# EasyEDA Pro project ProPrj_Compact_LED_Driver_PWM_Single_ATtiny1616_Double_2024-10-07.epro, board PCB1
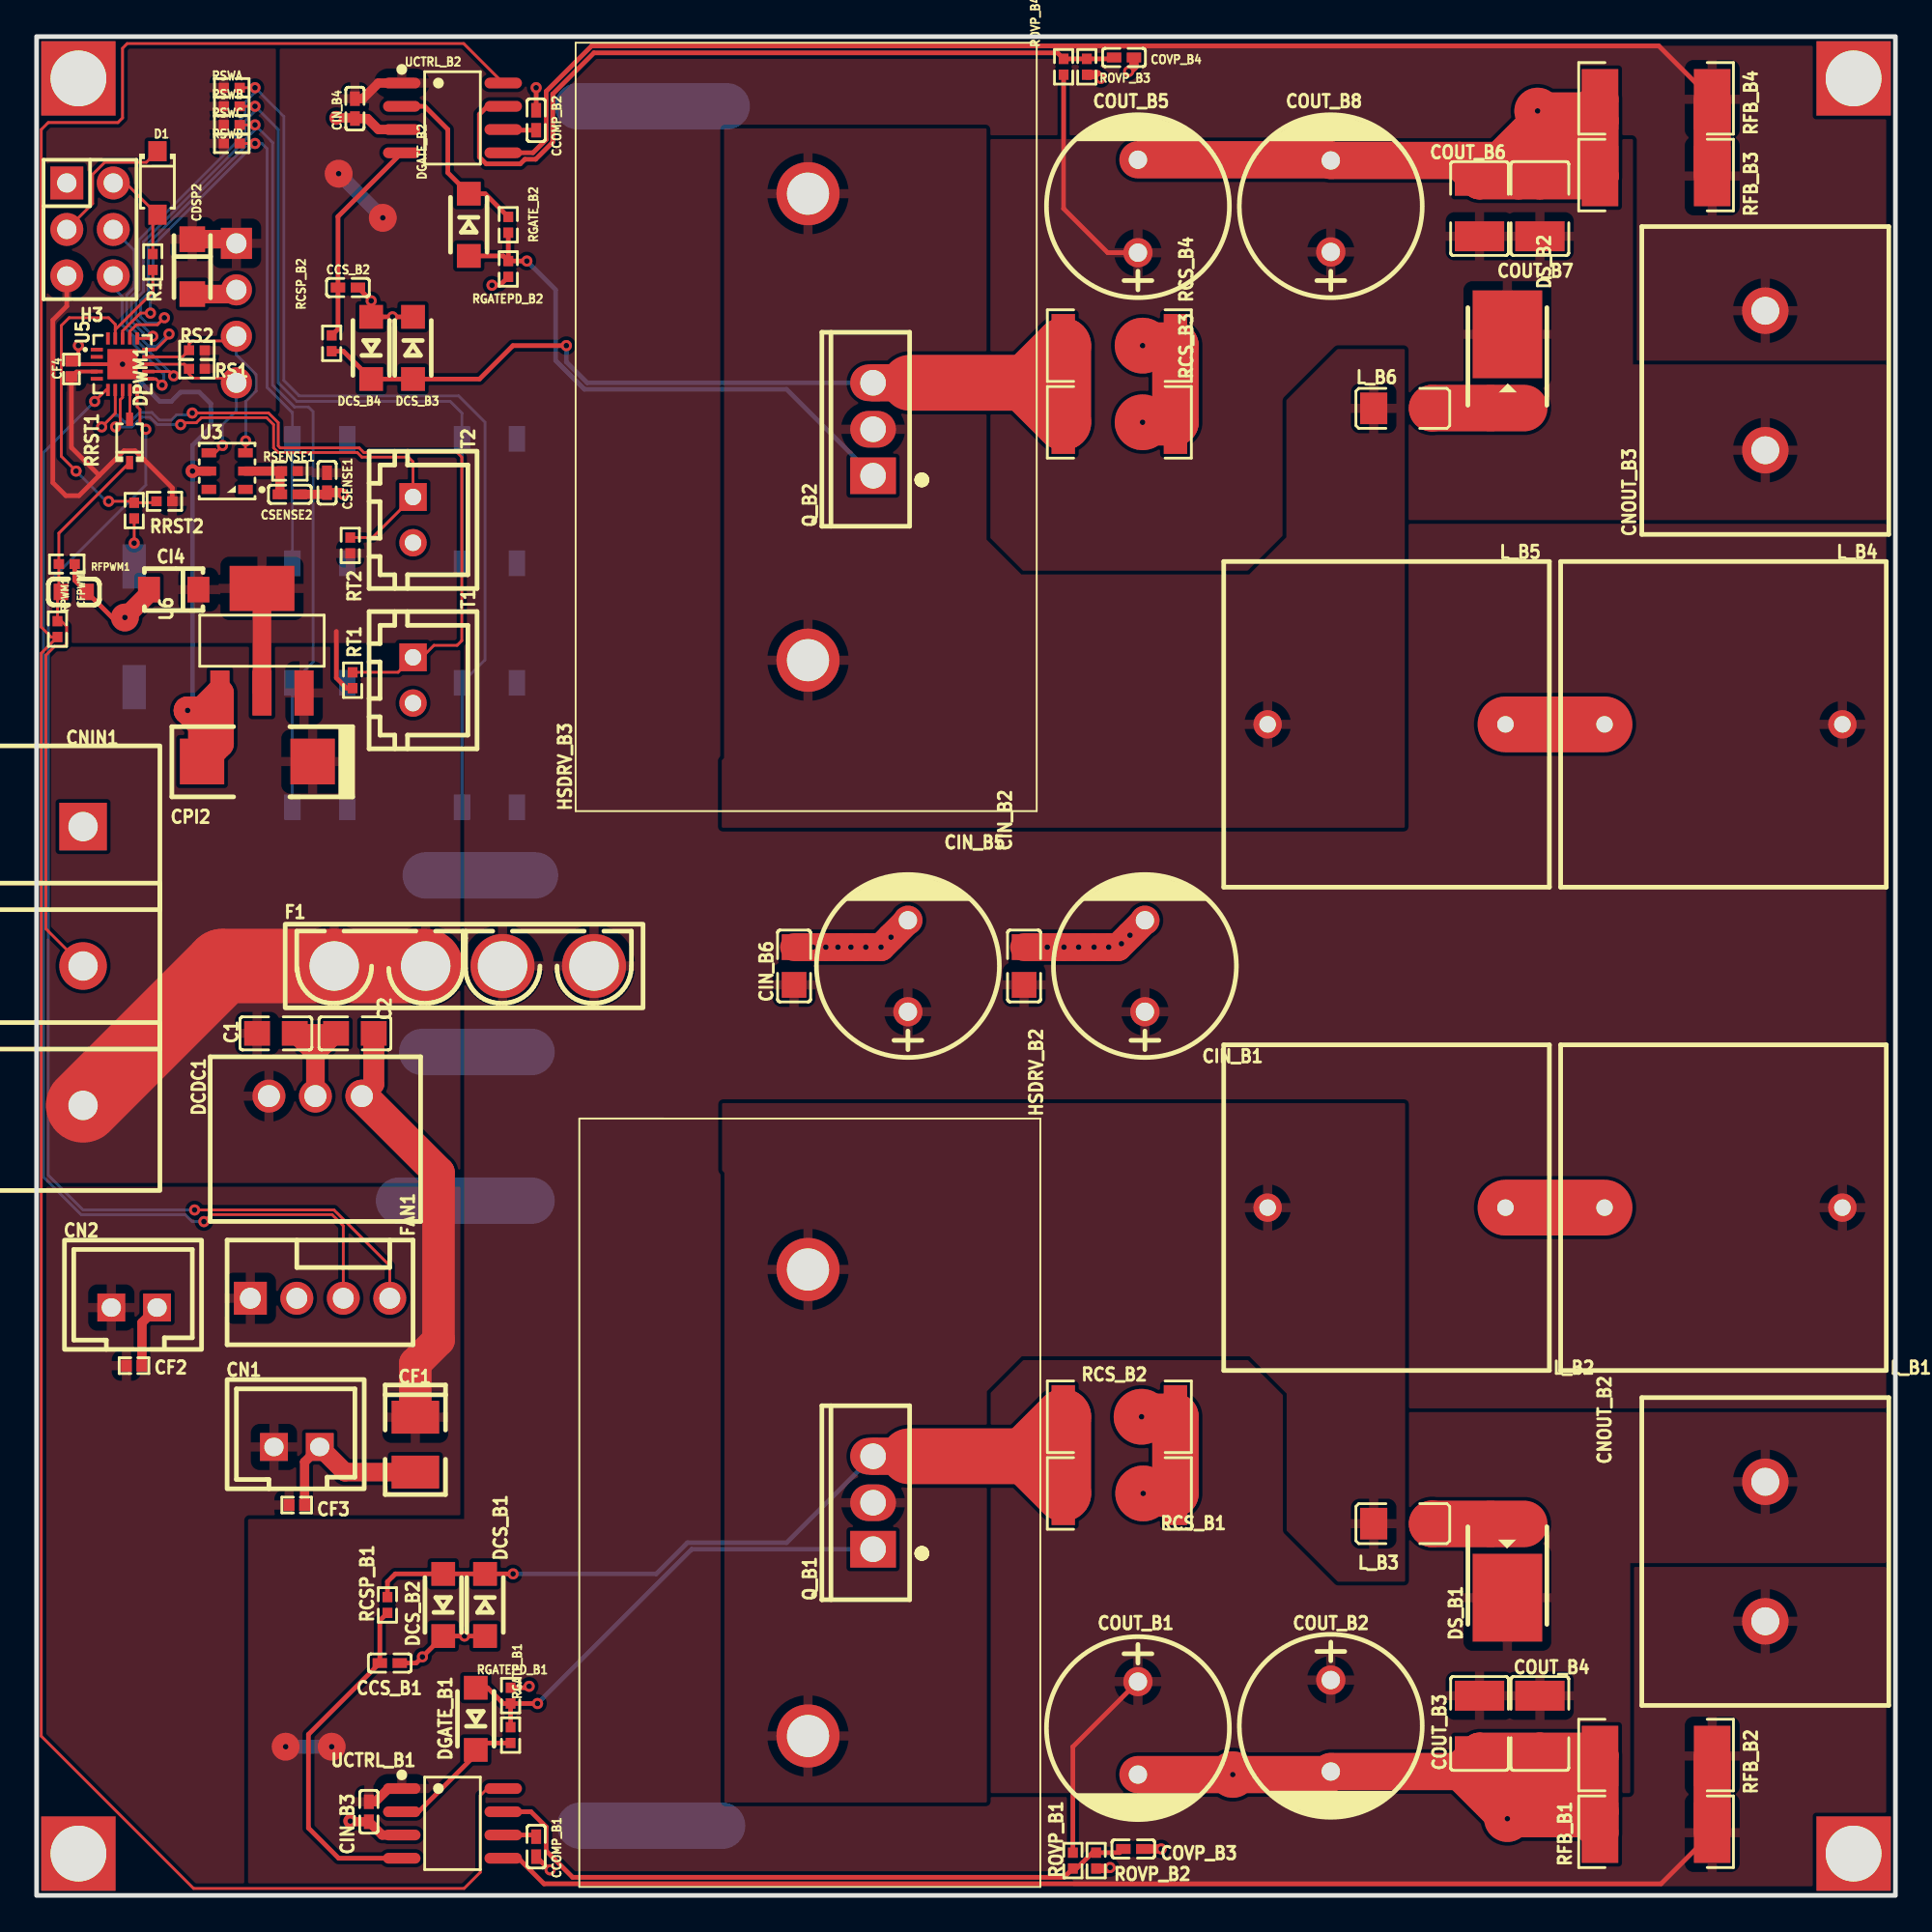
[diagram p1: board, top side]
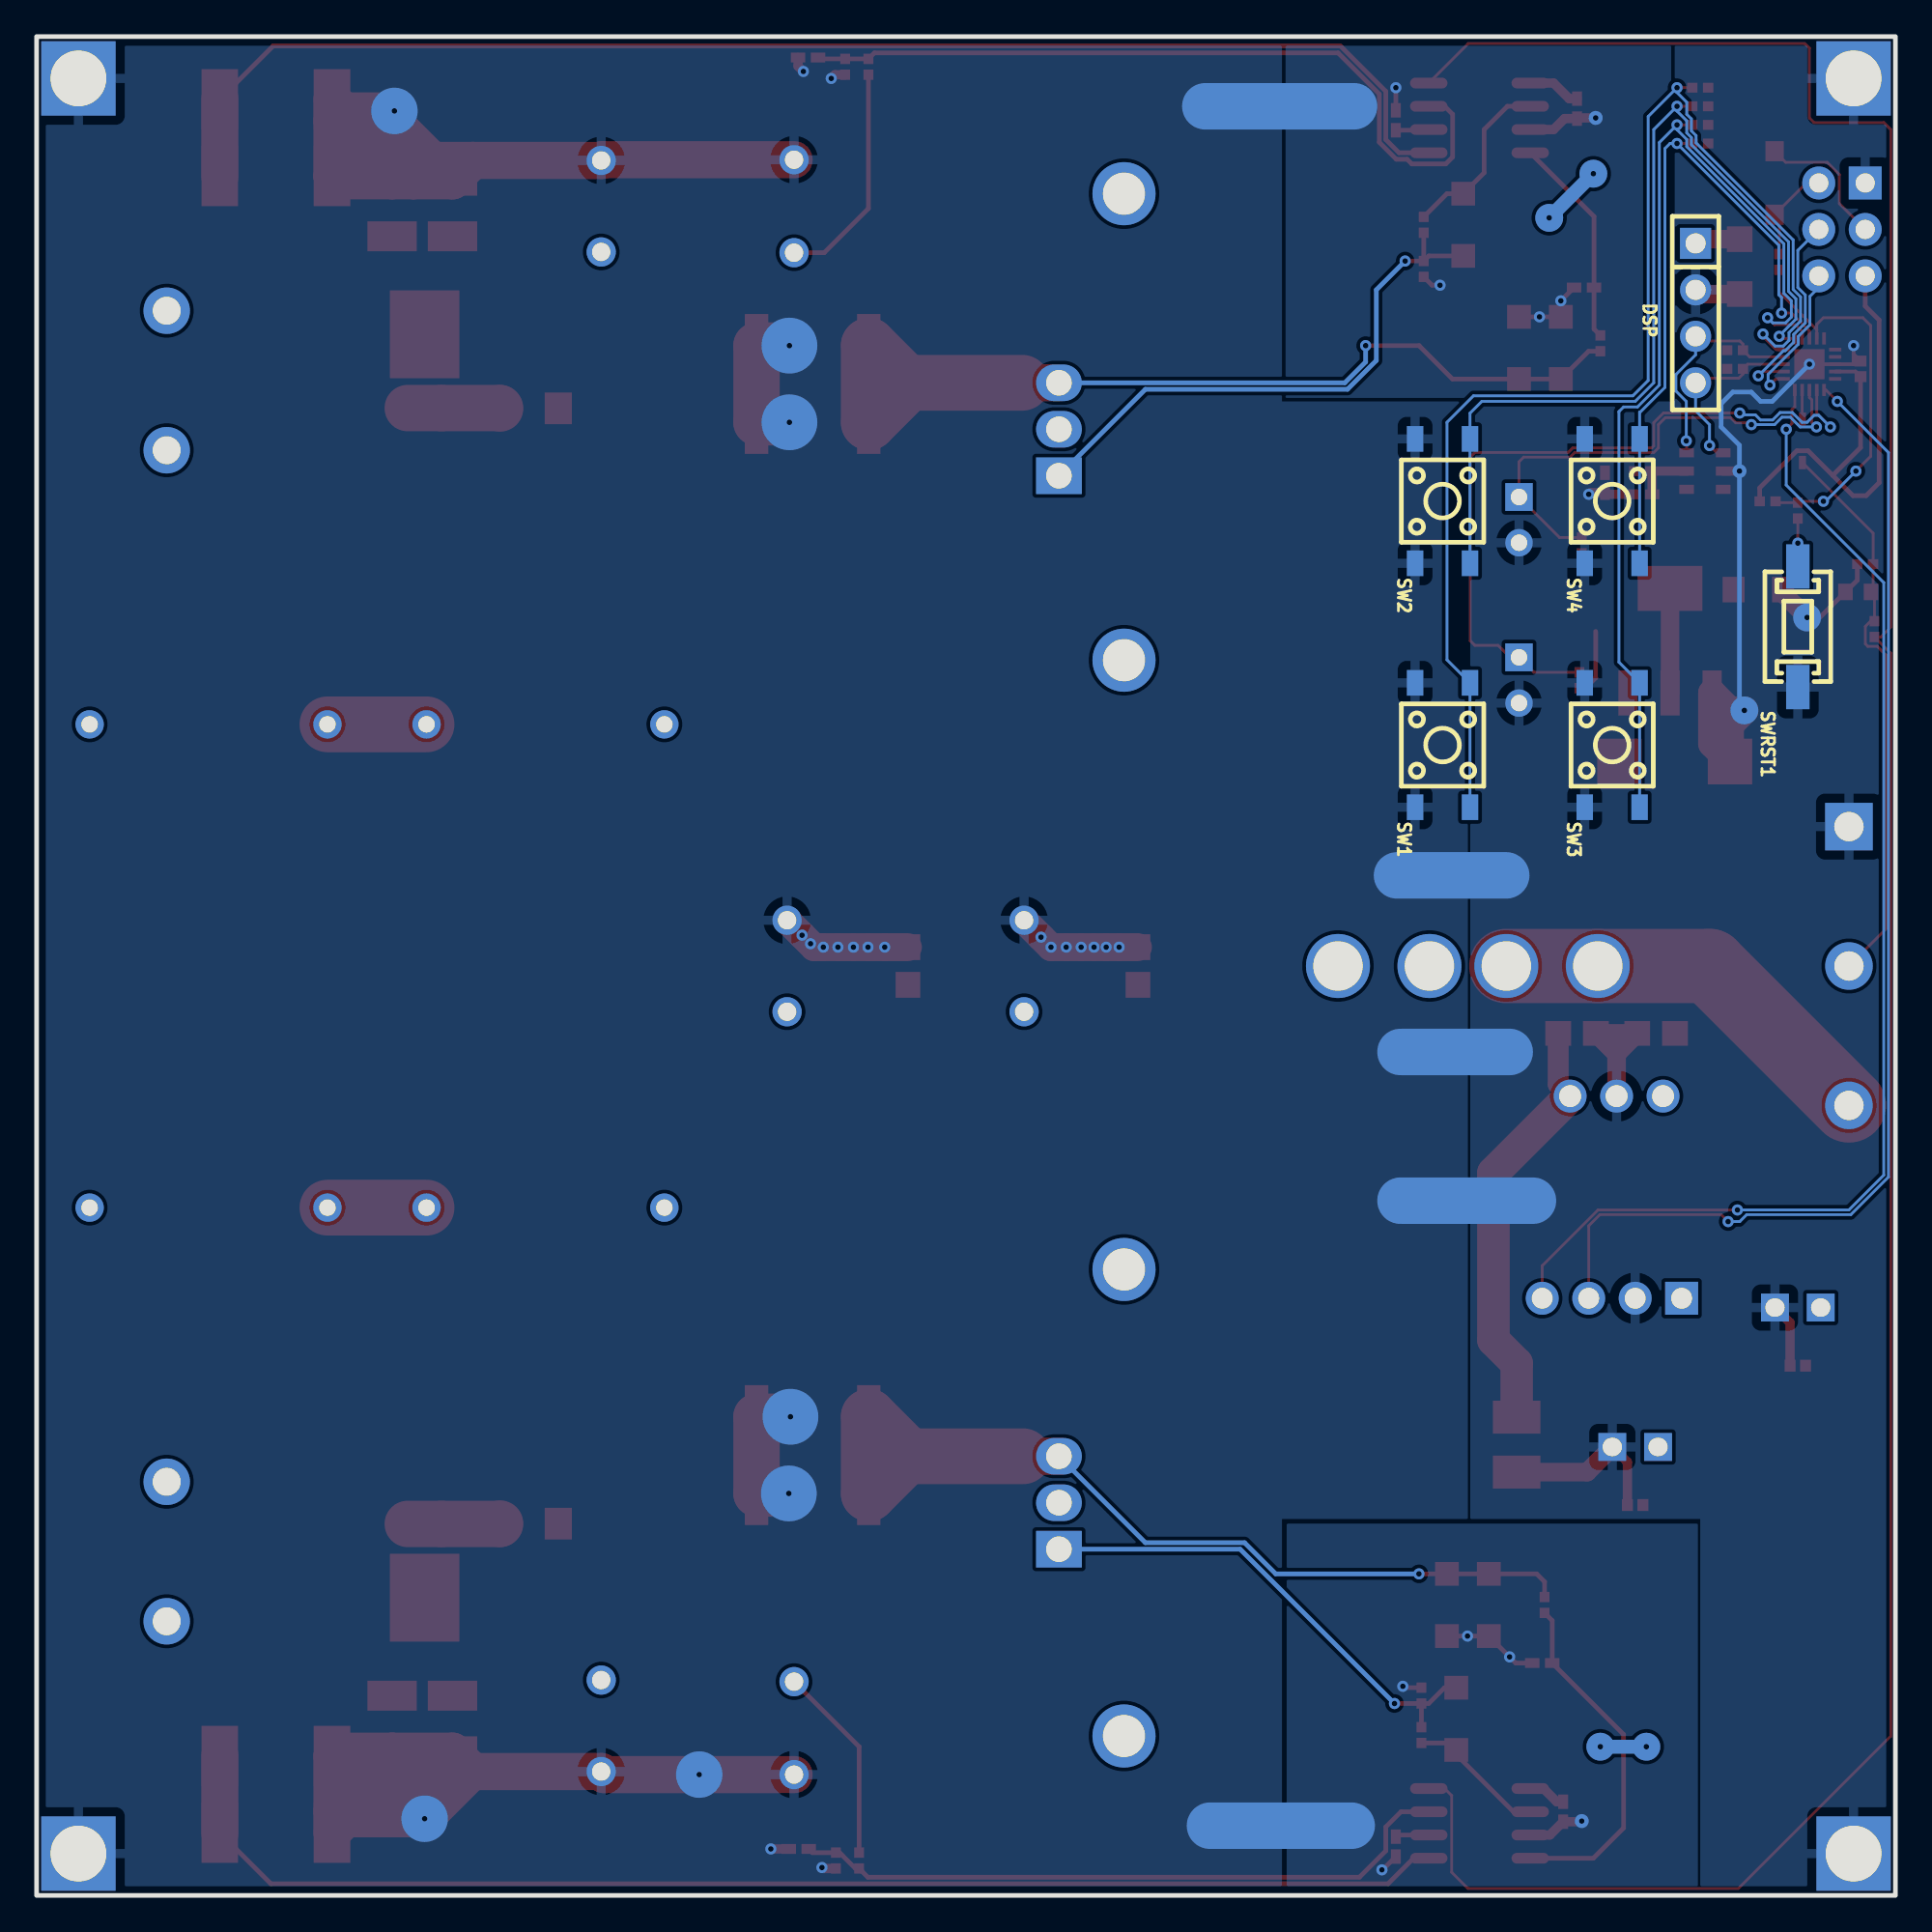
[diagram p2: board, bottom side, seen from below]

Outline 101.6 x 101.6 mm; copper layers: Top Layer, Bottom Layer. Coordinates in mm from the lower left corner of the outline.
Outline path: rectangle 0,101.6 101.6,0
Stack: Top Layer 0.035mm / Dielectric1 1.51mm FR4 er 4.5 / Bottom Layer 0.035mm

## Design rules (mm)
template: Custom Config
spacing copperThickness1oz (default): track to track 0.102, other pairs 0.025 to 0.3
spacing copperThickness2oz: track to track 0.203, other pairs 0.152 to 0.3
track width copperThickness1oz (default): min 0.127, default 0.254, max 5.08
track width copperThickness2oz: min 0.203, default 0.254, max 2.54
differential pair differentialPair (default): width min 0.127, default 0.254, max 2.54; gap min 0.152, default 0.152
via viaSize (default): diameter min 0.5, default 0.61, max 10; hole min 0.3, default 0.305, max 6.299

## Placement (name value [footprint] x y rotation side)
C1  22uF  [C0805]  13.08 47.12 0 top
C2  22uF  [C0805]  17.4 47.12 180 top
CCOMP_B1  220nF  [C0402]  27.31 2.67 270 top
CCOMP_B2  220nF  [C0402]  27.31 97.03 90 top
CCS_B1  100pF  [C0402]  19.3 12.7 0 top
CCS_B2  100pF  [C0402]  17.02 87.88 0 top
CDSP2  10uF  [CAP-SMD_L3.2-W1.6-R-RD]  8.51 89.03 90 top
CF1  10uF  [CAP-SMD_L3.5-W2.8]  20.7 24.64 270 top
CF2  1uF  [0402]  5.33 28.96 0 top
CF3  1uF  [0402]  14.22 21.34 0 top
CF4  1uF  [0402]  1.91 83.44 90 top
CFPWM1  1nF  [C0603]  2.03 71.25 180 top
CI4  10uF  [CAP-SMD_L3.2-W1.6]  7.49 71.37 180 top
CIN_B1  100uF  [CAP-TH_BD10.0-P5.00-D0.6-FD-A]  60.58 50.8 90 top
CIN_B2  10uF  [C0805]  53.97 50.8 90 top
CIN_B3  1uF  [C0402]  18.16 4.57 90 top
CIN_B4  1uF  [C0402]  17.4 97.66 90 top
CIN_B5  100uF  [CAP-TH_BD10.0-P5.00-D0.6-FD-A]  47.62 50.8 90 top
CIN_B6  10uF  [C0805]  41.4 50.8 90 top
CN1  WAFER-XH2.54-2PZZ  [CONN-TH_XH2.54-2P]  14.22 24.51 0 top
CN2  WAFER-XH2.54-2PZZ  [CONN-TH_XH2.54-2P]  5.33 32.13 0 top
CNIN1  DBT50G-7.62-3P-BK-P  [CONN-TH_3P-P7.62_L15.2-W24.4-EX4.2]  2.54 50.8 270 top
CNOUT_B2  WJ25C-B-2P  [CONN-TH_2P-P7.62_WJ25C-B-7.62-2P]  94.49 18.8 270 top
CNOUT_B3  WJ25C-B-2P  [CONN-TH_2P-P7.62_WJ25C-B-7.62-2P]  94.49 82.8 90 top
COUT_B1  330uF  [CAP-TH_BD10.0-P5.00-D1.0-FD]  60.2 9.14 270 top
COUT_B2  220uF  [CAP-TH_BD10.0-P5.00-D0.6-FD-A]  70.74 9.27 270 top
COUT_B3  4.7uF  [C1210]  78.87 9.4 90 top
COUT_B4  4.7uF  [C1210]  82.17 9.4 90 top
COUT_B5  330uF  [CAP-TH_BD10.0-P5.00-D1.0-FD]  60.2 92.33 90 top
COUT_B6  4.7uF  [C1210]  78.87 92.2 270 top
COUT_B7  4.7uF  [C1210]  82.17 92.2 270 top
COUT_B8  220uF  [CAP-TH_BD10.0-P5.00-D0.6-FD-A]  70.74 92.33 90 top
COVP_B3  470pF  [C0402]  59.94 2.54 180 top
COVP_B4  470pF  [C0402]  59.44 100.46 180 top
CPI2  10uF  [CASE-C_6032]  12.06 61.98 0 top
CSENSE1  10uF  [C0402]  15.88 77.22 90 top
CSENSE2  100nF  [C0402]  13.84 76.58 180 top
D1  B5819W  [SOD-123F_L2.7-W1.6-LS3.8-RD-1]  6.6 93.6 270 top
DCDC1  K7812-1000  [PWRM-TH_K78XX-1000]  15.24 43.69 0 top
DCS_B1  MMSD4148T3G  [SOD-123FL_L2.6-W1.6-LS3.4-RD]  24.51 15.88 270 top
DCS_B2  MMSD4148T3G  [SOD-123FL_L2.6-W1.6-LS3.4-RD]  22.22 15.88 90 top
DCS_B3  MMSD4148T3G  [SOD-123FL_L2.6-W1.6-LS3.4-RD]  20.57 84.58 270 top
DCS_B4  MMSD4148T3G  [SOD-123FL_L2.6-W1.6-LS3.4-RD]  18.29 84.58 90 top
DGATE_B1  MMSD4148T3G  [SOD-123FL_L2.6-W1.6-LS3.4-RD]  24 9.65 90 top
DGATE_B2  MMSD4148T3G  [SOD-123FL_L2.6-W1.6-LS3.4-RD]  23.62 91.31 270 top
DPWM1  CUS08F30,H3F  [SOD-323F_L2.0-W1.6-LS2.5-RD]  5.08 79.5 90 top
DS_B1  ST2045  [TO-277_3P-L5.4-W4.0-LS6.5-BR]  80.39 18.29 90 top
DS_B2  ST2045  [TO-277_3P-L5.4-W4.0-LS6.5-BR]  80.39 83.31 270 top
DSP  2.54-1*4P母  [HDR-TH_4P-P2.54-V-F]  10.92 86.49 270 bottom
F1  XF-507P  [CONN-TH_XF-507P]  23.37 50.8 0 top
FAN1  HF1004E  [CONN-TH_4P-P2.54_HF1004E]  15.49 32.64 0 top
H3  Header-Male-2.54_2x3  [HDR-TH_6P-P2.54-V-M-R2-C3-S2.54-1]  2.92 91.06 270 top
HSDRV_B2  -  [xsd366094]  42.16 21.46 270 top
HSDRV_B3  -  [xsd366094]  42.16 80.26 90 top
L_B1  47uH  [IND-TH_L17.8-W17.8-P13.00-D0.6]  92.2 37.59 180 top
L_B2  47uH  [IND-TH_L17.8-W17.8-P13.00-D0.6]  73.79 37.59 180 top
L_B3  HCB3216KF-300T80  [L1206]  74.68 20.32 0 top
L_B4  47uH  [IND-TH_L17.8-W17.8-P13.00-D0.6]  92.2 64.01 180 top
L_B5  47uH  [IND-TH_L17.8-W17.8-P13.00-D0.6]  73.79 64.01 180 top
L_B6  HCB3216KF-300T80  [L1206]  74.68 81.28 0 top
NOREF  -  [Pad_e112]  99.31 99.31 0 top
NOREF#2  -  [Pad_e110]  2.29 2.29 0 top
NOREF#3  -  [Pad_e108]  2.29 99.31 0 top
NOREF#4  -  [Pad_e111]  99.31 2.29 0 top
Q_B1  LPN1510C  [TO-220-3_L10.0-W4.5-P2.54-L]  45.72 21.46 90 top
Q_B2  LPN1510C  [TO-220-3_L10.0-W4.5-P2.54-L]  45.72 80.14 90 top
R1  470Ω  [R0402]  6.35 89.28 270 top
RCS_B1  60mΩ  [R2512]  59.18 21.97 180 top
RCS_B2  60mΩ  [R2512]  59.18 26.16 180 top
RCS_B3  60mΩ  [R2512]  59.18 80.52 180 top
RCS_B4  60mΩ  [R2512]  59.18 84.71 180 top
RCSP_B1  100Ω  [R0402]  19.18 15.88 90 top
RCSP_B2  100Ω  [R0402]  16.13 84.84 270 top
RFB_B1  130mΩ  [RES-SMD_L6.4-W3.2-R2512]  88.52 3.43 0 top
RFB_B2  130mΩ  [RES-SMD_L6.4-W3.2-R2512]  88.52 7.62 0 top
RFB_B3  130mΩ  [RES-SMD_L6.4-W3.2-R2512]  88.52 93.98 0 top
RFB_B4  130mΩ  [RES-SMD_L6.4-W3.2-R2512]  88.52 98.17 0 top
RFPWM1  20kΩ  [R0402]  1.65 72.77 180 top
RGATE_B1  10Ω  [R0402]  25.91 8.76 270 top
RGATE_B2  10Ω  [R0402]  25.78 91.31 90 top
RGATEPD_B1  10kΩ  [R0402]  25.91 10.92 270 top
RGATEPD_B2  10kΩ  [R0402]  25.78 88.9 90 top
ROVP_B1  360kΩ  [R0402]  56.64 1.91 90 top
ROVP_B2  18.7kΩ  [R0402]  57.91 1.91 90 top
ROVP_B3  18.7kΩ  [R0402]  57.4 99.95 90 top
ROVP_B4  360kΩ  [R0402]  56.13 99.95 270 top
RPWM1  1kΩ  [R0402]  1.14 69.21 90 top
RRST1  100Ω  [R0402]  5.33 75.69 270 top
RRST2  10kΩ  [R0402]  6.98 76.2 0 top
RS1  1kΩ  [R0402]  8.76 83.44 0 top
RS2  1kΩ  [R0402]  8.76 84.45 0 top
RSENSE1  220Ω  [R0402]  13.84 77.85 180 top
RSWA  10kΩ  [R0402]  10.67 98.81 180 top
RSWB  10kΩ  [R0402]  10.67 97.79 180 top
RSWC  10kΩ  [R0402]  10.67 96.77 180 top
RSWD  10kΩ  [R0402]  10.67 95.76 180 top
RT1  10kΩ  [R0402]  17.27 66.42 90 top
RT2  10kΩ  [R0402]  17.14 73.79 90 top
SW1  TS4543TP 250gf 009  [SW-SMD_4P-L4.5-W4.5-P3.00-LS6.9]  24.75 62.88 90 bottom
SW2  TS4543TP 250gf 009  [SW-SMD_4P-L4.5-W4.5-P3.00-LS6.9]  24.75 76.21 90 bottom
SW3  TS4543TP 250gf 009  [SW-SMD_4P-L4.5-W4.5-P3.00-LS6.9]  15.48 62.88 90 bottom
SW4  TS4543TP 250gf 009  [SW-SMD_4P-L4.5-W4.5-P3.00-LS6.9]  15.48 76.21 90 bottom
SWRST1  TSB008A2518A  [SW-SMD_L6.0-W3.5-LS8.2]  5.33 69.34 90 bottom
T1  HC-XH-2A-G  [CONN-TH_2P-P2.50_HC-XH-2A-G]  20.57 66.42 270 top
T2  HC-XH-2A-G  [CONN-TH_2P-P2.50_HC-XH-2A-G]  20.57 75.18 270 top
U3  AHT20  [SENSOR-SMD_L3.0-W3.0-P1.00-BR]  10.41 77.85 0 top
U5  ATTINY1616-MNR  [QFN-20_L3.0-W3.0-P0.40-BL-EP1.7]  4.7 83.69 270 top
U6  SK1117-5.0  [SOT-223_L6.5-W3.5-P2.30-LS7.0-BR]  12.32 68.58 270 top
UCTRL_B1  AL3353S-13  [SOIC-8_L4.9-W3.9-P1.27-LS6.0-BL]  22.73 3.94 270 top
UCTRL_B2  AL3353S-13  [SOIC-8_L4.9-W3.9-P1.27-LS6.0-BL]  22.73 97.16 270 top

## Footprints (pads in the part's own frame, mm; a bottom-side part is the same pattern mirrored in y, then rotated)
0402
  rect 0.6x0.65 smd: 1(-0.424,0) 2(0.424,0)
C0402
  rect 0.79x0.54 smd: 1(-0.545,0) 2(0.545,0)
C0603
  rect 0.8x0.9 smd: 1(-0.7,0) 2(0.7,0)
C0805
  rect 1.41x1.35 smd: 1(-1.03,0) 2(1.03,0)
C1210
  rect 1.635x2.7 smd: 1(-1.518,0) 2(1.518,0)
CAP-SMD_L3.2-W1.6
  rect 1.2x1.4 smd: 1(-1.35,0) 2(1.35,0)
CAP-SMD_L3.2-W1.6-R-RD
  rect 1.4x1.4 smd: 1(1.5,0) 2(-1.5,0)
CAP-SMD_L3.5-W2.8
  rect 1.8x2.6 smd: 1(-1.501,0) 2(1.501,0)
CAP-TH_BD10.0-P5.00-D0.6-FD-A
  round 1.6 hole 1: 1(-2.5,0) 2(2.5,0)
CAP-TH_BD10.0-P5.00-D1.0-FD
  round 1.6 hole 1: 1(-2.54,0) 2(2.54,0)
CASE-C_6032
  rect 2.425x2.5 smd: 1(3.022,0) 2(-3.022,0)
CONN-TH_2P-P2.50_HC-XH-2A-G
  rect 1.524x1.5 hole 0.9: 1(-1.25,0)
  round 1.5 hole 0.9: 2(1.25,0)
CONN-TH_2P-P7.62_WJ25C-B-7.62-2P
  round 2.54 hole 1.524: 1(-3.812,0) 2(3.812,0)
CONN-TH_3P-P7.62_L15.2-W24.4-EX4.2
  rect 2.6x2.6 hole 1.6: 1(-7.62,0)
  round 2.6 hole 1.6: 2(0,0) 3(7.62,0)
CONN-TH_4P-P2.54_HF1004E
  rect 1.8x1.8 hole 1.14: 1(-3.81,0)
  round 1.8 hole 1.14: 2(-1.27,0) 3(1.27,0) 4(3.81,0)
CONN-TH_XF-507P
  round 3.5 hole 2.7: 1(-7.1,0) 2(-2.1,0) 3(2.1,0) 4(7.1,0)
CONN-TH_XH2.54-2P
  rect 1.524x1.524 hole 1.05x1: 1(-1.25,0) 2(1.25,0)
HDR-TH_4P-P2.54-V-F
  rect 1.7x1.7 hole 1.1: 1(-3.81,0)
  round 1.7 hole 1.1: 2(-1.27,0) 3(1.27,0) 4(3.81,0)
HDR-TH_6P-P2.54-V-M-R2-C3-S2.54-1
  rect 1.8x1.8 hole 1.05: 1(-2.54,-1.27)
  round 1.8 hole 1.05: 2(-2.54,1.27) 3(0,-1.27) 4(0,1.27) 5(2.54,-1.27) 6(2.54,1.27)
IND-TH_L17.8-W17.8-P13.00-D0.6
  round 1.55 hole 0.9: 1(-6.5,0) 2(6.5,0)
L1206
  rect 1.485x1.728 smd: 1(-1.593,0) 2(1.593,0)
Pad_e108
  rect 4.064x4.064 hole 3.048: 33(0,0)
Pad_e110
  rect 4.064x4.064 hole 3.048: 33(0,0)
Pad_e111
  rect 4.064x4.064 hole 3.048: 33(0,0)
Pad_e112
  rect 4.064x4.064 hole 3.048: 33(0,0)
PWRM-TH_K78XX-1000
  round 1.8 hole 1.2: 1(-2.54,0) 2(0,0) 3(2.54,0)
QFN-20_L3.0-W3.0-P0.40-BL-EP1.7
  rect 0.2x0.665 smd: 1(-0.8,-1.407) 2(-0.4,-1.407) 3(0,-1.407) 4(0.4,-1.407) 5(0.8,-1.407) 11(0.8,1.407) 12(0.4,1.407) 13(0,1.407) 14(-0.4,1.407) 15(-0.8,1.407)
  rect 0.665x0.2 smd: 6(1.407,-0.8) 7(1.407,-0.4) 8(1.407,0) 9(1.407,0.4) 10(1.407,0.8) 16(-1.407,0.8) 17(-1.407,0.4) 18(-1.407,0) 19(-1.407,-0.4) 20(-1.407,-0.8)
  rect 1.65x1.65 smd: 21(0,0)
R0402
  rect 0.566x0.54 smd: 1(-0.433,0) 2(0.433,0)
R2512
  rect 1.282x3.456 smd: 1(-3.067,0) 2(3.067,0)
RES-SMD_L6.4-W3.2-R2512
  rect 2x3.3 smd: 1(-3.067,0) 2(3.067,0)
SENSOR-SMD_L3.0-W3.0-P1.00-BR
  rect 0.8x0.5 smd: 1(1,-1) 2(1,0) 3(1,1) 4(-1,1) 5(-1,0) 6(-1,-1)
SOD-123F_L2.7-W1.6-LS3.8-RD-1
  rect 1.1x1 smd: 1(-1.735,0) 2(1.735,0)
SOD-123FL_L2.6-W1.6-LS3.4-RD
  rect 1.3x1.3 smd: 1(-1.7,0) 2(1.7,0)
SOD-323F_L2.0-W1.6-LS2.5-RD
  rect 0.73x0.385 smd: 1(-1.185,0) 2(1.185,0)
SOIC-8_L4.9-W3.9-P1.27-LS6.0-BL
  oval 0.588x2.045 smd: 1(-1.905,-2.772) 2(-0.635,-2.772) 3(0.635,-2.772) 4(1.905,-2.772) 5(1.905,2.772) 6(0.635,2.772) 7(-0.635,2.772) 8(-1.905,2.772)
SOT-223_L6.5-W3.5-P2.30-LS7.0-BR
  rect 2.465x1.05 smd: 1(2.857,-2.3) 2(2.857,0) 3(2.857,2.3)
  rect 2.465x3.54 smd: 4(-2.857,0)
SW-SMD_4P-L4.5-W4.5-P3.00-LS6.9
  rect 1.4x0.9 smd: 1(-3.4,1.5) 2(3.4,1.5) 3(-3.4,-1.5) 4(3.4,-1.5)
SW-SMD_L6.0-W3.5-LS8.2
  rect 2.42x1.28 smd: 1(-3.296,0) 2(3.296,0)
TO-220-3_L10.0-W4.5-P2.54-L
  rect 2x2.5 hole 1.4: 1(-2.54,0)
  oval 2x2.5 hole 1.4: 2(0,0) 3(2.54,0)
TO-277_3P-L5.4-W4.0-LS6.5-BR
  rect 1.29x1.423 smd: 1(2.017,-0.92) 3(2.017,0.92)
  rect 4.8x3.8 smd: 2(-2.017,0)
xsd366094
  round 3.45 hole 2.3: 1(-12.749,0) 2(12.749,0)

## Nets
As in the schematic, except:
AGND: C1.2 C2.2 CCOMP_B1.2 CCOMP_B2.2 CCS_B1.2 CCS_B2.2 CDSP2.2 CF1.2 CF2.2 CF3.2 CF4.2 CFPWM1.1 CI4.2 CIN_B1.2 CIN_B2.2 CIN_B3.1 CIN_B4.1 CIN_B5.2 CIN_B6.2 CN1.2 CN2.2 CNIN1.1 COUT_B1.2 COUT_B2.2 COUT_B3.1 COUT_B4.1 COUT_B5.2 COUT_B6.1 COUT_B7.1 COUT_B8.2 COVP_B3.1 COVP_B4.1 CPI2.2 CSENSE1.1 CSENSE2.1 DCDC1.2 DCS_B1.2 DCS_B2.1 DCS_B3.1 DCS_B4.2 DSP.2 FAN1.2 H3.1 NOREF.33 NOREF#2.33 NOREF#3.33 NOREF#4.33 RCS_B1.1 RCS_B2.1 RCS_B3.1 RCS_B4.1 RFB_B1.1 RFB_B2.1 RFB_B3.1 RFB_B4.1 RFPWM1.1 RGATEPD_B1.1 RGATEPD_B2.1 ROVP_B2.1 ROVP_B3.1 SW1.1 SW1.2 SW2.1 SW2.2 SW3.1 SW3.2 SW4.1 SW4.2 SWRST1.1 T1.2 T2.2 U3.5 U5.3 U5.21 U6.1 UCTRL_B1.3 UCTRL_B2.3

Pads without a net: U3 1 6; U5 1 2 5 20

## Via types
v1: diameter 0.61, hole 0.305, Top Layer to Bottom Layer, 55 vias
v2: diameter 2.54, hole 0.305, Top Layer to Bottom Layer, 1 via
v3: diameter 2.54, hole 0.3, Top Layer to Bottom Layer, 2 vias
v4: diameter 0.762, hole 0.305, Top Layer to Bottom Layer, 2 vias
v5: diameter 3.048, hole 0.305, Top Layer to Bottom Layer, 4 vias
v6: diameter 0.762, hole 0.3, Top Layer to Bottom Layer, 1 via
v7: diameter 1.524, hole 0.305, Top Layer to Bottom Layer, 6 vias
v8: diameter 0.61, hole 0.3, Top Layer to Bottom Layer, 1 via

## Routing (per net, layer and track width the routed paths; a pad name or vN(x,y) marks a point on that pad's centre or on a via; arc(x,y) is an arc through that point)
+5V: length 40.4
  Top Layer w0.203: U5.4 2.18,83.29 1.91,83.02
  Top Layer w0.254: RRST2.2 7.42,76.93 5.39,78.96 4.77,78.96 3.43,77.62 ; 3.43,77.62 1.91,79.14 1.91,83.02 ; 3.43,77.62 2.32,76.51 1.6,76.51 0.89,77.22 0.89,86.11 1.65,86.87 H3.5 ; RT1.1 16.94,65.99 16.38,66.55 16.38,69.09
  Top Layer w1.016: U6.2 U6.4 ; CDSP2.1 10.69,90.53 DSP.1
+12V: length 23.5
  Top Layer w1.143: C2.1 18.43,44.34 DCDC1.3
  Top Layer w1.778: CF1.1 20.7,29.08 21.97,30.35 21.97,39.5 DCDC1.3
AGND: length 276.6
  Top Layer w0.203: 2.29,84.24 2.29,83.72 2.31,83.69 ; 2.29,84.24 CF4.2 2.08,83.69 2.31,83.69 ; 2.29,84.24 v1(2.29,84.71) ; 2.31,83.69 U5.3 v1(4.7,83.69)
  Top Layer w0.254: RGATEPD_B2.1 25.33,88.01 v1(24.89,88.01) ; DCS_B1.2 v1(23.39,14.17) DCS_B2.1 v1(21.09,13.04) 20.75,12.7 CCS_B1.2 ; DCS_B3.1 v1(19.45,86.28) DCS_B4.2 v1(18.29,87.16) CCS_B2.2 ; v1(26.92,11.43) 26.85,11.35 RGATEPD_B1.1 ; v8(28.07,1.4) 28.03,1.4 CCOMP_B1.2 ; v1(27.31,98.81) CCOMP_B2.2 ; v7(4.83,69.85) 4.13,69.85 CFPWM1.1 2.72,71.25 2.08,71.88 RFPWM1.1
  Top Layer w0.508: CSENSE2.1 15.78,76.58 CSENSE1.1 16.67,76.67 v1(16.76,76.58) ; CF2.2 5.76,31.3 CN2.2 ; v1(58.17,99.31) 57.96,99.52 ROVP_B3.1 ; CF3.2 14.65,23.68 CN1.2 ; ROVP_B2.1 58.62,1.47 v1(58.67,1.52) ; UCTRL_B2.3 18.68,96.52 18.09,97.12 CIN_B4.1 17.36,97.16 v4(16.38,97.16) ; COVP_B4.1 59.98,99.99 v1(59.69,99.69) ; U3.5 v4(8.52,77.85) ; UCTRL_B1.3 18.89,3.3 CIN_B3.1 17.18,4.03 v6(17.14,4.06) ; v1(61.47,2.54) COVP_B3.1
  Top Layer w1.016: DCDC1.2 15.24,45.99 ; 15.24,45.99 C1.2 C2.2 15.24,45.99 ; v7(4.83,69.85) 6.14,71.17 CI4.2 ; CN1.2 16.85,23.14 CF1.2 ; DSP.2 10.69,87.53 8.51,87.53
  Top Layer w1.524: CIN_B2.2 v1(55.24,51.83) v1(56.16,51.83) v1(56.95,51.83) v1(57.8,51.83) v1(58.6,51.83) 59.11,51.83 v1(59.76,52.48) CIN_B1.2 ; CIN_B5.2 v1(46.7,52.38) v1(46.16,51.83) v1(45.32,51.83) v1(44.51,51.83) v1(43.8,51.83) v1(43.14,51.83) v1(42.43,51.83) CIN_B6.2 ; 10.02,62.95 CPI2.2 9.04,63.98 v7(8.25,64.77) 9.07,64.77 U6.1 10.02,62.95
  Top Layer w2.032: RFB_B2.1 85.19,7.88 COUT_B4.1 ; RFB_B2.1 85.45,4.6 ; RFB_B2.1 83.94,6.11 ; COUT_B6.1 81,93.72 ; COUT_B6.1 79.98,94.83 ; COUT_B6.1 77.76,94.83 ; 81,93.72 COUT_B7.1 ; 81,93.72 82.11,94.83 ; 82.43,93.98 83.28,94.83 ; 82.43,93.98 COUT_B7.1 ; 82.43,93.98 RFB_B3.1 ; 83.28,94.83 85.45,97 ; 83.28,94.83 82.11,94.83 ; 83.28,94.83 84.6,94.83 RFB_B3.1 ; COUT_B7.1 85.19,93.72 RFB_B3.1 ; 77.76,94.83 79.98,94.83 ; 77.76,94.83 COUT_B8.2 70.7,94.87 COUT_B5.2 ; 79.98,94.83 82.04,96.89 v2(82.04,97.54) 84.82,97.54 ; 79.98,94.83 82.11,94.83 ; RFB_B3.1 85.45,97 ; 84.82,97.54 RFB_B4.1 85.45,97 ; 84.82,97.54 82.11,94.83 ; COUT_B4.1 82.17,5.97 v3(80.39,4.19) ; COUT_B4.1 83.94,6.11 ; COUT_B4.1 COUT_B3.1 ; 83.94,6.11 85.45,4.6 ; 83.94,6.11 82.02,4.19 ; v3(80.39,4.19) 77.81,6.77 77.76,6.77 ; v3(80.39,4.19) 80.39,6.36 COUT_B3.1 ; v3(80.39,4.19) 82.02,4.19 ; 85.45,4.6 RFB_B1.1 84.69,4.19 82.02,4.19 ; COUT_B1.2 v3(65.38,6.6) 70.57,6.6 COUT_B2.2 77.76,6.77 ; 77.76,6.77 COUT_B3.1
  Top Layer w2.54: v5(60.48,21.97) RCS_B1.1 RCS_B2.1 v5(60.4,26.16) ; v5(60.45,84.71) RCS_B4.1 RCS_B3.1 v5(60.45,80.52)
  Bottom Layer w0.254: v1(4.7,83.69) 6.73,81.66 7.37,81.66 7.87,82.17 8.89,82.17 9.53,81.53 9.53,80.26 8.52,79.26 v4(8.52,77.85) 8.52,65.04 v7(8.25,64.77)
  Bottom Layer w2.54: 21.27,55.75 27.24,55.75 ; 29.59,97.79 37.72,97.79 ; 29.72,3.81 37.47,3.81 ; 21.08,46.1 27.05,46.1 ; 19.81,37.97 27.05,37.97
  vias: v1(59.3,52.02)
VCC: length 21.9
  Top Layer w4.064: F1.2 F1.1 10.16,50.8 CNIN1.3
VCCF: length 10.9
  Top Layer w0.508: CIN_B3.2 18.51,5.12 19.23,5.84 UCTRL_B1.1 ; UCTRL_B2.1 18.68,99.06 17.83,98.21 CIN_B4.2
  Bottom Layer w0.762: v7(18.92,91.69) v7(16.51,94.11) ; v7(13.61,8.13) v7(16.13,8.13)
VDD: length 3.3
  Top Layer w0.508: CSENSE2.2 13.3,77.74 RSENSE1.2 U3.2
MC_PWM_LED: length 1.6
  Top Layer w0.152: DPWM1.2 5.1,80.71 U5.9
NTC1: length 41.4
  Top Layer w0.152: v1(3.56,80.26) 4.3,81.01 4.3,82.29 ; RT1.2 19.76,66.85 T1.1 21.06,67.67 21.72,68.33 22.99,68.33 23.24,68.58 23.24,78.61 22.99,78.87 17.89,78.87 17.63,79.12 13.31,79.12 13.21,79.23 13.21,80.5 12.68,81.03 v1(8.51,81.03)
  Bottom Layer w0.152: v1(3.56,80.26) 4.19,80.9 4.44,80.9 4.83,80.52 5.1,80.52 5.64,81.05 6.3,81.05 6.71,80.64 7.37,80.64 7.65,80.92 8.41,80.92 v1(8.51,81.03)
NTC2: length 27
  Top Layer w0.152: v1(7.87,80.39) 7.98,80.49 8.73,80.49 9.01,80.77 12.57,80.77 12.95,80.39 12.95,79.12 13.21,78.87 17.53,78.87 17.78,78.61 20.32,78.61 20.57,78.36 T2.1 18.36,74.22 RT2.2 ; U5.8 4.7,81.88 4.57,81.75 4.57,80.52 v1(4.32,80.26)
  Bottom Layer w0.152: v1(4.32,80.26) 5.21,80.26 5.74,80.8 6.2,80.8 6.6,80.39 v1(7.87,80.39)
PWM_FAN: length 67.8
  Top Layer w0.152: v1(5.97,80.14) 5.65,80.45 5.65,81.22 5.5,81.37 U5.10 ; v1(8.64,37.46) 16.26,37.46 19.3,34.42 FAN1.4
  Bottom Layer w0.152: v1(8.64,37.46) 2.54,37.46 0.64,39.37 0.64,71.75 5.97,77.09 v1(5.97,80.14)
PWM_LED: length 31.2
  Top Layer w0.152: CNIN1.2 0.51,52.83 0.51,67.79 0.99,68.27 1.51,68.27 1.64,68.4 1.64,69.36 1.36,69.65 RPWM1.2 1.14,71.06 CFPWM1.2 1.22,71.36 RFPWM1.2 1.22,74.46 DPWM1.1
PWM_LED_O: length 152.5
  Top Layer w0.152: UCTRL_B1.8 24.64,5.84 24.25,5.46 24.25,1.27 23.37,0.38 8.58,0.38 0.25,8.71 0.25,67.89 RPWM1.1 0.8,68.78 0.25,69.32 0.25,96.52 0.64,96.9 4.44,96.9 4.7,97.16 4.7,100.97 4.95,101.22 23.35,101.22 UCTRL_B2.8
RPM_FAN: length 66.3
  Top Layer w0.152: v1(3.17,81.66) 3.8,82.29 U5.6 ; FAN1.3 16.76,36.6 16.15,37.21 9.53,37.21 v1(9.14,36.83)
  Bottom Layer w0.152: v1(9.14,36.83) 8.51,36.83 8.13,37.21 2.44,37.21 0.38,39.27 0.38,78.87 v1(3.17,81.66)
RX: length 8.1
  Top Layer w0.152: v1(6.86,82.55) 6.52,82.89 U5.11
  Bottom Layer w0.152: H3.6 4.19,87.88 4.67,87.4 4.67,85.84 5.31,85.21 5.31,84.79 6.96,83.13 6.96,82.65 v1(6.86,82.55)
SCL: length 12.5
  Top Layer w0.152: DSP.3 10.67,84.96 8.5,84.96 8.33,84.79 RS2.1 7.97,84.09 6.11,84.09 ; U3.3 11.41,79.49 v1(11.43,79.5)
  Bottom Layer w0.152: DSP.3 10.92,84.2 12,83.12 12,82.23 11.43,81.66 v1(11.43,79.5)
SDA: length 10.1
  Top Layer w0.152: U3.4 9.76,78.85 v1(10.16,79.25) ; U5.13 8.08,83.69 RS1.1 8.33,83.16 8.56,82.93 10.67,82.93 DSP.4
  Bottom Layer w0.152: v1(10.16,79.25) 10.16,80.39 10.92,81.15 DSP.4
SWA: length 71.3
  Top Layer w0.152: 11.1,98.81 v1(11.94,98.81) ; U5.15 6.52,84.49 7.24,85.22 v1(7.24,85.34)
  Bottom Layer w0.152: SW1.3 SW1.4 24.51,67.53 24.51,80.52 23.06,81.97 14.35,81.97 13.51,82.8 13.51,97.23 v1(11.94,98.81) 11.94,98.54 11.4,98.01 11.4,97.35 11.15,97.1 11.15,96.44 10.9,96.19 10.9,95.79 5.59,90.49 5.59,87.78 5.18,87.37 5.18,86.06 5.82,85.42 5.82,85 6.13,84.68 6.58,84.68 v1(7.24,85.34)
SWB: length 52
  Top Layer w0.152: v1(11.94,97.79) 11.1,97.79 ; v1(6.35,85.22) 6.23,85.1 U5.16
  Bottom Layer w0.152: SW2.3 SW2.4 23.25,81.01 22.61,81.66 14.22,81.66 13.21,82.68 13.21,96.52 v1(11.94,97.79) 11.94,97.53 11.4,97 11.4,96.34 11.15,96.08 11.15,95.69 5.84,90.38 5.84,87.67 5.44,87.27 5.44,86.16 6.35,85.25 v1(6.35,85.22)
SWC: length 57.6
  Top Layer w0.152: v1(6.98,86.23) 6.6,85.85 5.46,85.85 5.1,85.49 U5.17 ; v1(11.94,96.77) 11.1,96.77
  Bottom Layer w0.152: v1(6.98,86.23) 6.71,85.95 6,85.95 5.69,86.27 5.69,87.16 6.1,87.57 6.1,90.27 11.4,95.58 11.4,95.98 11.94,96.51 v1(11.94,96.77) 12.9,95.81 12.9,82.55 14.1,81.36 14.86,81.36 15.11,81.1 15.11,67.41 SW3.4 SW3.3
SWD: length 38.9
  Top Layer w0.152: v1(6.22,86.49) 5.68,86.49 4.7,85.51 U5.18 ; 11.1,95.76 v1(11.94,95.76)
  Bottom Layer w0.152: v1(6.22,86.49) 6.22,87.34 6.38,87.49 6.38,90.2 v1(11.94,95.76) 12.32,95.76 12.6,95.48 12.6,82.42 13.97,81.05 13.98,81.07 SW4.4 SW4.3
TX: length 11.2
  Top Layer w0.152: v1(7.49,83.06) 7.26,83.29 U5.12
  Bottom Layer w0.152: v1(7.49,83.06) 6.12,84.43 6.02,84.43 5.56,84.89 5.56,85.32 4.93,85.95 4.93,87.48 5.33,87.88 5.33,89.92 H3.4
UDPI: length 21.6
  Top Layer w0.152: v1(3.94,76.2) 5.26,76.2 RRST1.1 6.48,76.12 RRST2.1 ; 4.3,85.58 6.35,87.63 R1.2 ; 4.3,85.58 4.3,85.87 3.94,86.23 1.78,86.23 1.35,85.81 1.35,78.66 v1(2.16,77.85) ; 4.3,85.58 4.3,85.1
  Bottom Layer w0.152: v1(2.16,77.85) 3.81,76.2 v1(3.94,76.2)
V+LED_B_1: length 10.8
  Top Layer w0.254: COUT_B1.1 56.64,8.13 ROVP_B1.2
V+LED_B_2: length 12.4
  Top Layer w0.254: COUT_B5.1 58.55,89.79 56.13,92.2 ROVP_B4.2
V-LED_B_1: length 72
  Top Layer w0.254: RFB_B1.2 88.79,0.63 27.73,0.63 26.33,2.03 UCTRL_B1.5
  Top Layer w2.032: RFB_B1.2 RFB_B2.2
V-LED_B_2: length 75.4
  Top Layer w0.254: RFB_B4.2 88.66,101.09 30.34,101.09 27.85,98.61 27.85,95.97 27.13,95.25 UCTRL_B2.5
  Top Layer w2.032: RFB_B4.2 RFB_B3.2
$1N8682: length 5
  Top Layer w2.54: 81.31,20.3 DS_B1.3 76.28,20.3 L_B3.2
$1N8688: length 5.4
  Top Layer w3.048: L_B2.1 L_B1.2
$1N8707: length 1.8
  Top Layer w0.254: CCOMP_B1.1 27.22,3.3 UCTRL_B1.6
$1N8712: length 7.4
  Top Layer w0.254: 24,7.7 20.88,4.57 UCTRL_B1.2 ; RGATE_B1.2 24.38,8.33 DGATE_B1.1
$1N8739: length 48.7
  Top Layer w0.254: v1(26.04,17.57) DCS_B1.1 DCS_B2.2 19.61,17.57 19.18,17.14 RCSP_B1.2
  Top Layer w2.032: Q_B1.3 47.68,24
  Top Layer w3.048: 53.96,24 RCS_B2.2 RCS_B1.2 54.08,24 53.96,24 ; 53.96,24 47.68,24
  Bottom Layer w0.254: Q_B1.3 41,19.28 35.57,19.28 33.87,17.57 v1(26.04,17.57)
$1N8772: length 26.9
  Top Layer w0.254: DGATE_B1.2 24.65,11.35 25.51,10.49 RGATEPD_B1.2 ; RGATEPD_B1.2 RGATE_B1.1 ; RGATEPD_B1.2 v1(27.38,10.49)
  Bottom Layer w0.254: v1(27.38,10.49) 35.81,18.92 Q_B1.1
$1N8790: length 19.3
  Top Layer w0.254: RCSP_B1.1 18.76,15.02 CCS_B1.1 14.86,8.8 14.86,3.68 16.51,2.03 UCTRL_B1.4
$1N8797: length 36.8
  Top Layer w0.254: UCTRL_B1.7 27.02,4.57 27.85,3.74 27.85,2.44 29.3,0.99 56.16,0.99 ROVP_B1.1 56.84,1.47 57.71,2.34 ROVP_B2.2 59.2,2.34 COVP_B3.2
$1N25369: length 7.7
  Top Layer w0.152: H3.3 3.06,92.47 3.06,94.07 3.72,94.73 6,94.73 D1.1
$1N25378: length 5.4
  Top Layer w0.152: R1.1 6.35,91.61 D1.2 4.87,93.6 H3.2
$1N26156: length 2.6
  Top Layer w0.152: v1(5.33,73.91) 5.33,75.26
  Bottom Layer w0.152: v1(5.33,73.91) SWRST1.2
$1N34640: length 5
  Top Layer w2.54: 81.31,81.3 DS_B2.1 76.28,81.3 L_B6.2
$1N34641: length 5.4
  Top Layer w3.048: L_B5.1 L_B4.2
$1N34643: length 1.8
  Top Layer w0.254: UCTRL_B2.6 25.54,96.48 27.31,96.48
$1N34645: length 9.7
  Top Layer w0.254: UCTRL_B2.2 21.21,97.79 22.48,96.52 22.48,94.16 23.62,93.01 24.51,93.01 RGATE_B2.2
$1N34649: length 30.9
  Top Layer w0.254: RGATEPD_B2.2 25.5,89.61 DGATE_B2.2 ; RGATEPD_B2.2 v1(26.8,89.33) ; RGATEPD_B2.2 RGATE_B2.1
  Bottom Layer w0.254: v1(26.8,89.33) 28.37,87.76 28.37,83.9 29.95,82.32 41,82.32 Q_B2.1
$1N34651: length 11.6
  Top Layer w0.254: UCTRL_B2.4 16.47,91.76 CCS_B2.1 16.47,85.61 16.13,85.27
$1N34652: length 42.9
  Top Layer w0.254: COVP_B4.2 58.82,100.38 ROVP_B3.2 ROVP_B4.1 55.81,100.71 30.46,100.71 28.21,98.46 28.21,95.82 27.28,94.89 26.69,94.89 26.44,94.64 24.58,94.64 24.2,95.01 24.2,97.36 24.64,97.79 UCTRL_B2.7
$1N34653: length 50.8
  Top Layer w0.254: RCSP_B2.2 16.77,84.4 DCS_B4.1 DCS_B3.2 24.21,82.88 26.03,84.71 v1(28.96,84.71)
  Top Layer w2.032: 45.72,82.68 47.73,82.68
  Top Layer w3.048: 53.96,82.68 54.08,82.68 RCS_B4.2 RCS_B3.2 53.96,82.68 ; 53.96,82.68 47.73,82.68
  Bottom Layer w0.254: 45.72,82.68 30.09,82.68 28.96,83.81 v1(28.96,84.71)

## Copper pours and planes (outline as drawn; the poured copper is in the pictures)
+5V on Top Layer: 13.08,104.39 -2.79,104.39 -2.79,68.45 23.37,68.45 23.37,78.99 13.08,78.99
+12V on Top Layer: -11.68,38.73 24.38,38.73 24.38,-3.56 -11.68,-3.56
AGND on Bottom Layer: 23.37,81.66 33.53,81.66 33.53,102.87 103,102.87 103,46.74 23.37,46.74
AGND on Bottom Layer: 12.26,105.35 33.34,105.35 33.34,81.85 12.26,81.85
AGND on Bottom Layer: 12.06,105.16 12.06,81.66 23.24,81.66 23.24,20.57 10.67,20.57 10.67,-3.18 -4.19,-3.18 -4.19,105.16
AGND on Bottom Layer: 10.8,20.32 33.27,20.32 33.27,-3.18 10.8,-3.18
AGND on Bottom Layer: 23.37,20.57 33.53,20.57 33.53,-0.64 103,-0.64 103,55.5 23.37,55.5
VCC on Top Layer: -10.16,68.71 24.51,68.71 24.51,37.46 -10.16,37.46
VCCF on Top Layer: 13.08,104.39 13.08,78.99 23.37,78.99 23.37,20.57 11.56,20.57 11.56,-1.9 104.9,-1.9 104.9,104.39
V+LED_B_1 on Top Layer: 51.94,5.59 87.11,5.59 87.11,18.16 106.93,18.16 106.93,26.42 68.33,26.42 68.33,27.43 66.29,29.46 53.85,29.46 51.94,27.56
V+LED_B_2 on Top Layer: 51.97,96 87.26,96 87.26,83.68 106.96,83.68 106.96,75.17 68.35,75.17 68.35,74.16 66.32,72.12 53.87,72.12 51.97,74.03
V-LED_B_1 on Top Layer: 56.64,18.16 109.73,18.16 109.73,-1.52 56.64,-1.52
V-LED_B_2 on Top Layer: 56.26,103.31 109.35,103.31 109.35,83.63 56.26,83.63
VL_B_1 on Top Layer: 37.59,39.5 37.59,5.08 51.94,5.08 51.94,27.56 53.85,29.46 66.29,29.46 68.33,27.43 68.33,19.94 71.12,17.14 74.8,17.14 74.8,43.31 37.47,43.31 37.47,39.62
VL_B_2 on Top Layer: 37.57,62.17 37.57,96.58 51.92,96.58 51.92,74.11 53.83,72.2 66.28,72.2 68.31,74.23 68.31,81.73 71.1,84.52 74.78,84.52 74.78,58.36 37.45,58.36 37.45,62.04
